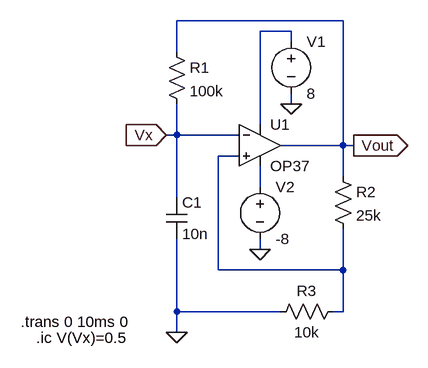
[diagram p0: schematic Fig4.asc]
Fig4.asc, the LTspice schematic file:
Version 4
SHEET 1 880 680
WIRE 304 -32 48 -32
WIRE 224 -16 176 -16
WIRE 224 0 224 -16
WIRE 48 16 48 -32
WIRE 224 96 224 80
WIRE 176 128 176 -16
WIRE 48 144 48 96
WIRE 48 144 32 144
WIRE 144 144 48 144
WIRE 304 160 304 -32
WIRE 304 160 208 160
WIRE 320 160 304 160
WIRE 144 176 112 176
WIRE 304 208 304 160
WIRE 176 224 176 192
WIRE 48 240 48 144
WIRE 176 320 176 304
WIRE 112 352 112 176
WIRE 304 352 304 288
WIRE 304 352 112 352
WIRE 48 416 48 304
WIRE 208 416 48 416
WIRE 304 416 304 352
WIRE 304 416 288 416
WIRE 48 448 48 416
FLAG 224 96 0
FLAG 176 320 0
FLAG 48 448 0
FLAG 32 144 Vx
IOPIN 32 144 In
FLAG 320 160 Vout
IOPIN 320 160 Out
SYMBOL Opamps\\OP37 176 96 R0
SYMATTR InstName U1
SYMBOL voltage 224 -16 R0
WINDOW 123 0 0 Left 0
WINDOW 39 0 0 Left 0
SYMATTR InstName V1
SYMATTR Value 8
SYMBOL voltage 176 208 R0
WINDOW 123 0 0 Left 0
WINDOW 39 0 0 Left 0
SYMATTR InstName V2
SYMATTR Value -8
SYMBOL res 32 0 R0
SYMATTR InstName R1
SYMATTR Value 100k
SYMBOL res 288 192 R0
SYMATTR InstName R2
SYMATTR Value 25k
SYMBOL res 304 400 R90
WINDOW 0 0 56 VBottom 2
WINDOW 3 32 56 VTop 2
SYMATTR InstName R3
SYMATTR Value 10k
SYMBOL cap 32 240 R0
SYMATTR InstName C1
SYMATTR Value 10n
TEXT -168 456 Left 2 !.ic V(Vx)=0.5
TEXT -192 432 Left 2 !.trans 0 10ms 0

The netlist it stands for:
* Fig4.asc
XU1 N002 Vx N001 N003 Vout LT1037  ; OP37, pins In+ In- V+ V- OUT
V1 N001 0 8
V2 N003 0 -8
R1 Vout Vx 100k
R2 Vout N002 25k
R3 N002 0 10k
C1 Vx 0 10n
.ic V(Vx)=0.5
.trans 0 10ms 0
.lib LTC.lib
.backanno
.end